# Altium schematic sheet RF_antenna.SchDoc
size A3; SheetNumber: 4; SheetTotal: 4
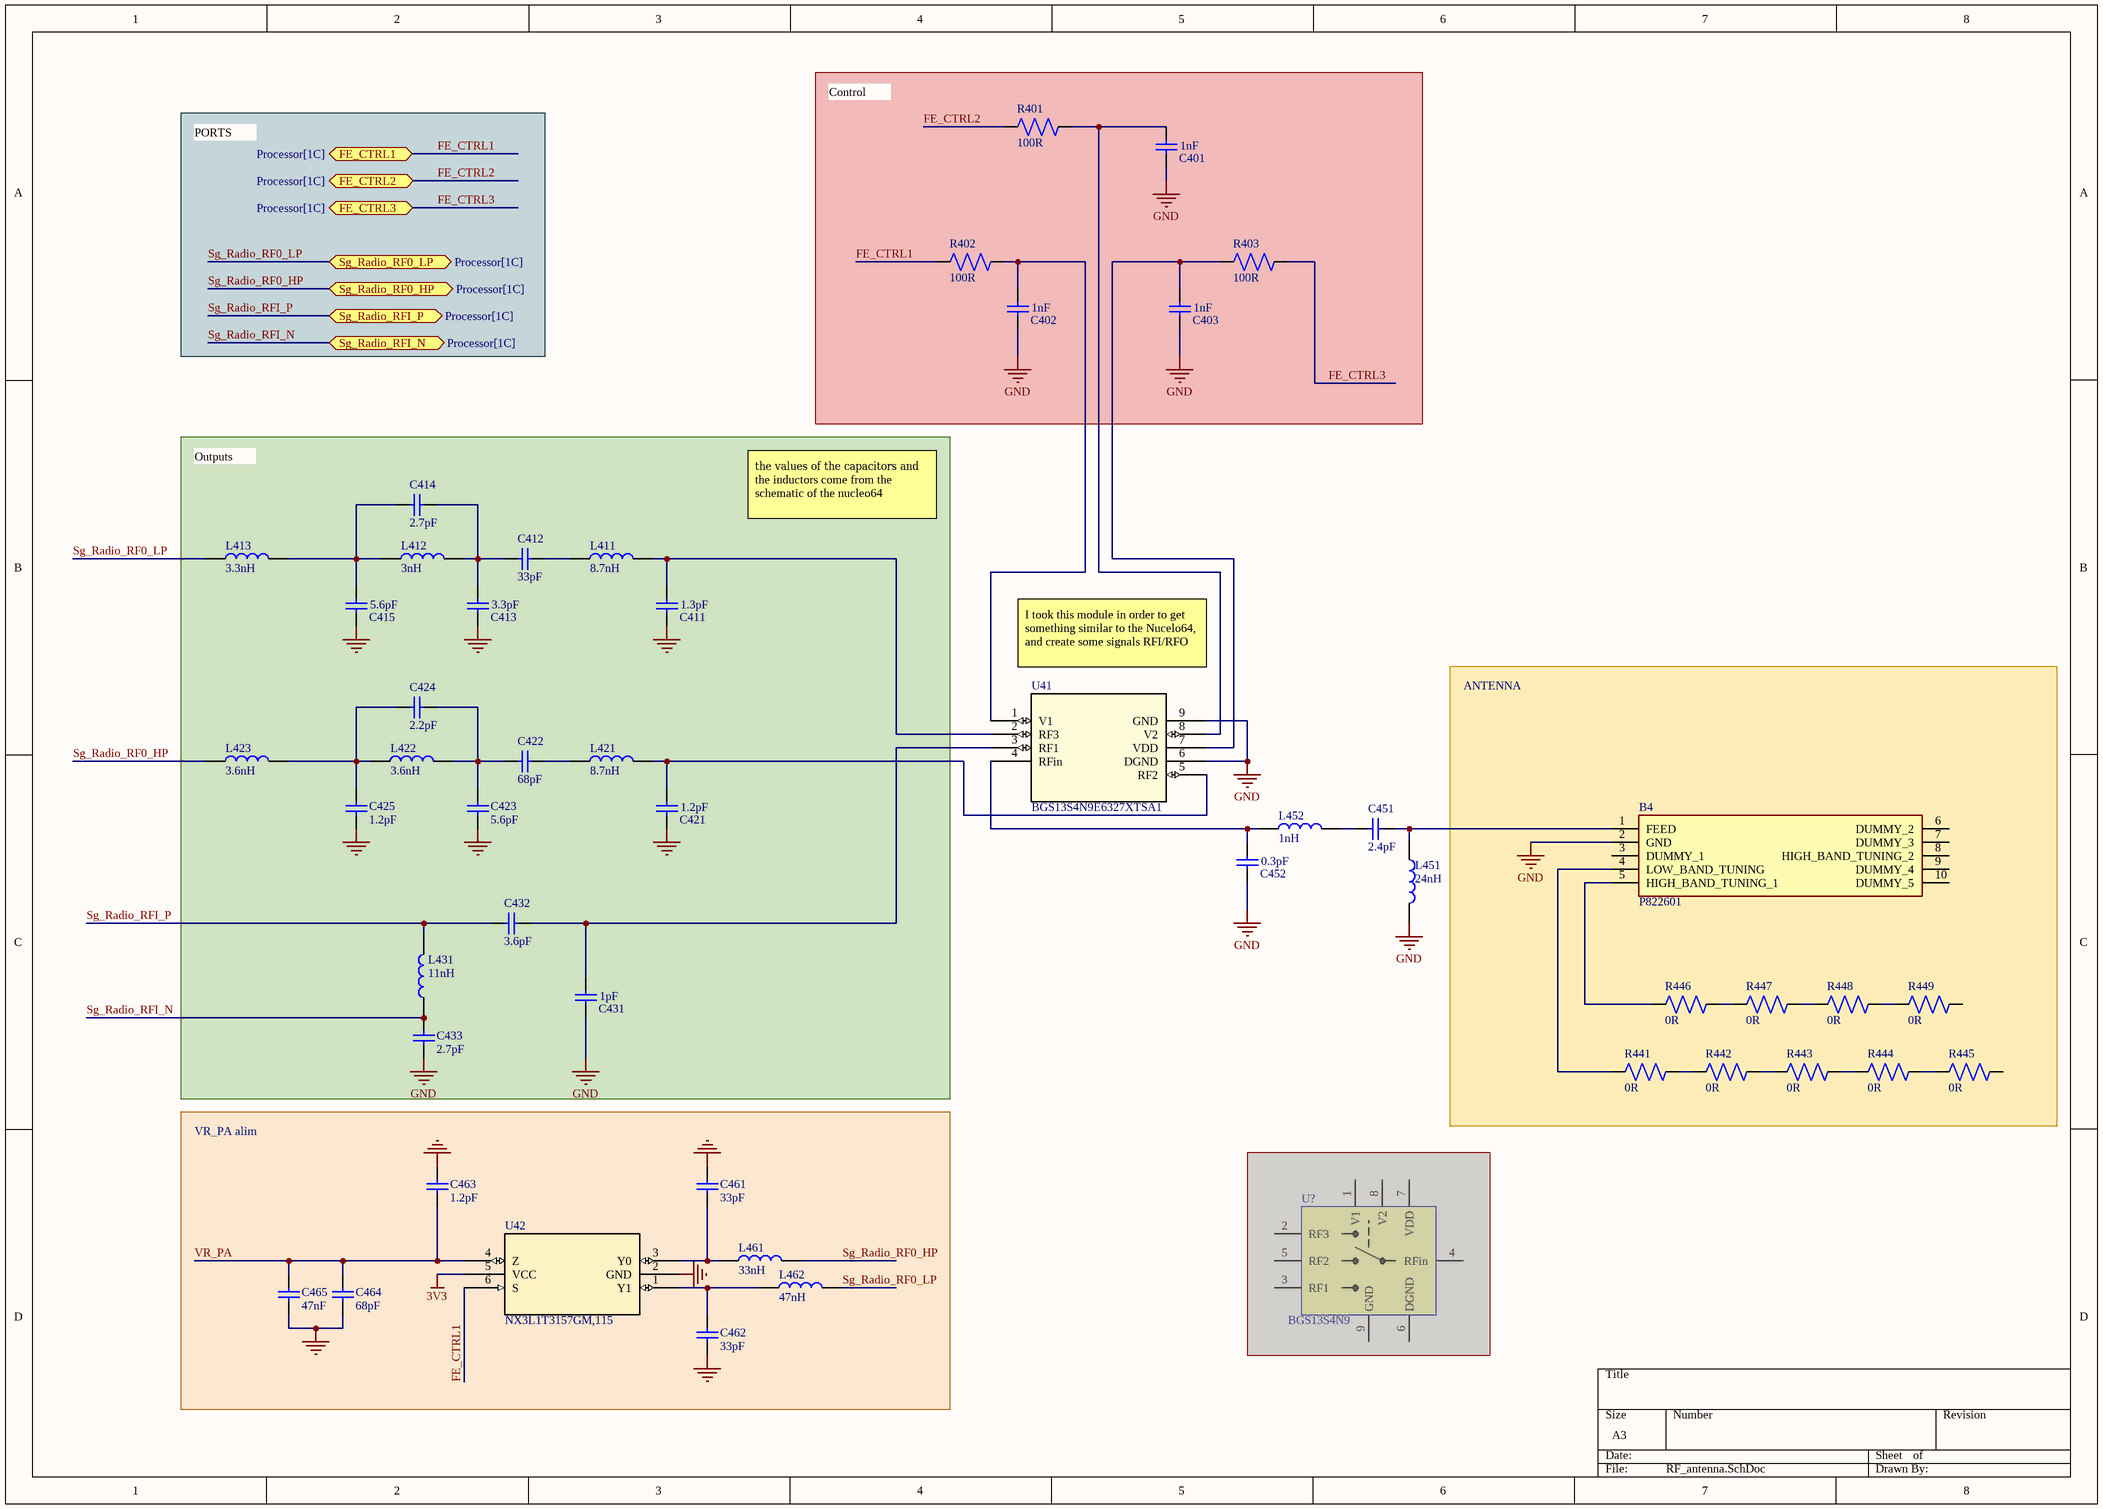
[diagram p0: RF_antenna.SchDoc]

## Parts
B4  P822601  [P822601]
C401  1nF  [CAPC1608X06L]
C402  1nF  [CAPC1608X06L]
C403  1nF  [CAPC1608X06L]
C411  1.3pF  [CAPC1608X06L]
C412  33pF  [CAPC1608X06L]
C413  3.3pF  [CAPC1608X06L]
C414  2.7pF  [CAPC1608X06L]
C415  5.6pF  [CAPC1608X06L]
C421  1.2pF  [CAPC1608X06L]
C422  68pF  [CAPC1608X06L]
C423  5.6pF  [CAPC1608X06L]
C424  2.2pF  [CAPC1608X06L]
C425  1.2pF  [CAPC1608X06L]
C431  1pF  [CAPC1608X06L]
C432  3.6pF  [CAPC1608X06L]
C433  2.7pF  [CAPC1608X06L]
C451  2.4pF  [CAPC1608X06L]
C452  0.3pF  [CAPC1608X06L]
C461  33pF  [CAPC1608X06L]
C462  33pF  [CAPC1608X06L]
C463  1.2pF  [CAPC1608X06L]
C464  68pF  [CAPC1608X06L]
C465  47nF  [CAPC1608X06L]
L411  8.7nH  [INDC1608X06L_WW]
L412  3nH  [INDC1608X06L_WW]
L413  3.3nH  [INDC1608X06L_WW]
L421  8.7nH  [INDC1608X06L_WW]
L422  3.6nH  [INDC1608X06L_WW]
L423  3.6nH  [INDC1608X06L_WW]
L431  11nH  [INDC1608X06L_WW]
L451  24nH  [INDC1608X06L_WW]
L452  1nH  [INDC1608X06L_WW]
L461  33nH  [INDC1608X06L_WW]
L462  47nH  [INDC1608X06L_WW]
R401  100R  [RESC1608X04.5L]
R402  100R  [RESC1608X04.5L]
R403  100R  [RESC1608X04.5L]
R441  0R  [RESC1608X04.5L]
R442  0R  [RESC1608X04.5L]
R443  0R  [RESC1608X04.5L]
R444  0R  [RESC1608X04.5L]
R445  0R  [RESC1608X04.5L]
R446  0R  [RESC1608X04.5L]
R447  0R  [RESC1608X04.5L]
R448  0R  [RESC1608X04.5L]
R449  0R  [RESC1608X04.5L]
U41  BGS13S4N9E6327XTSA1  [TSNP-9-3_INF]
U42  NX3L1T3157GM,115  [XSON6_SOT886_NXP]
U?  value BGS13S4N9  [ICC_TSNP-9-3_1P1X1P1_P040]  (masked out: inside a compile mask, not in the netlist)

## Blocks framed on the sheet
ANTENNA: B4 R441-R449
VR_PA alim: C461-C465 L461 L462 U42

## Ports
FE_CTRL1 (bidir, see Processor[1C]), FE_CTRL2 (bidir, see Processor[1C]), FE_CTRL3 (bidir, see Processor[1C]), Sg_Radio_RF0_HP (bidir, see Processor[1C]), Sg_Radio_RF0_LP (bidir, see Processor[1C]), Sg_Radio_RFI_N (bidir, see Processor[1C]), Sg_Radio_RFI_P (bidir, see Processor[1C])

## Nets
3V3: U42.5(VCC)
GND: B4.2(GND) C401.1 C402.1 C403.1 C411.1 C413.1 C415.1 C421.1 C423.2 C425.2 C431.1 C433.2 C452.1 C461.1 C462.2 C463.2 C464.2 C465.2 L451.2 U41.6(DGND) U41.9(GND) U42.2(GND)
FE_CTRL1: R402.1 U42.6(S) ; port FE_CTRL1
FE_CTRL2: R401.1 ; port FE_CTRL2
FE_CTRL3: R403.2 ; port FE_CTRL3
Sg_Radio_RF0_HP: L423.1 L461.2 ; port Sg_Radio_RF0_HP
Sg_Radio_RF0_LP: L413.1 L462.2 ; port Sg_Radio_RF0_LP
Sg_Radio_RFI_N: C433.1 L431.1 ; port Sg_Radio_RFI_N
Sg_Radio_RFI_P: C432.2 L431.2 ; port Sg_Radio_RFI_P
VR_PA: C463.1 C464.1 C465.1 U42.4(Z)
NetB4_1: B4.1(FEED) C451.1 L451.1
NetB4_4: B4.4(LOW_BAND_TUNING) R441.1
NetB4_5: B4.5(HIGH_BAND_TUNING_1) R446.1
NetC401_2: C401.2 R401.2 U41.8(V2)
NetC402_2: C402.2 R402.2 U41.1(V1)
NetC403_2: C403.2 R403.1 U41.7(VDD)
NetC411_2: C411.2 L411.2 U41.2(RF3)
NetC412_1: C412.1 L411.1
NetC412_2: C412.2 C413.2 C414.1 L412.2
NetC414_2: C414.2 C415.2 L412.1 L413.2
NetC421_2: C421.2 L421.2 U41.5(RF2)
NetC422_1: C422.1 L421.1
NetC422_2: C422.2 C423.1 C424.1 L422.2
NetC424_2: C424.2 C425.1 L422.1 L423.2
NetC431_2: C431.2 C432.1 U41.3(RF1)
NetC451_2: C451.2 L452.2
NetC452_2: C452.2 L452.1 U41.4(RFin)
NetC461_2: C461.2 L461.1 U42.3(Y0)
NetC462_1: C462.1 L462.1 U42.1(Y1)
NetR441_2: R441.2 R442.1
NetR442_2: R442.2 R443.1
NetR443_2: R443.2 R444.1
NetR444_2: R444.2 R445.1
NetR446_2: R446.2 R447.1
NetR447_2: R447.2 R448.1
NetR448_2: R448.2 R449.1

Not connected (* = marked no-connect by the designer): B4 3(DUMMY_1) 6(DUMMY_2) 7(DUMMY_3) 8(HIGH_BAND_TUNING_2) 9(DUMMY_4) 10(DUMMY_5); R445 2; R449 2

## Notes on the sheet
- Control
- PORTS
- Outputs
- the values ​​of the capacitors and the inductors come from the schematic of the nucleo64
- I took this module in order to get something similar to the Nucelo64, and create some signals RFI/RFO

## Library data of the parts
B4 = P822601: AVX - P822601 - EMBEDDED ANTENNA, 1.7-2.7GHZ, 3.4DBI; Geometry.Height: 3.5mm; Mouser Part Number: 581-P822601; Mouser Price/Stock: https://www.mouser.co.uk/ProductDetail/AVX/P822601?qs=vdi0iO8H4N0igrTLYxGIXg%3D%3D; Manufacturer_Name: AVX; Manufacturer_Part_Number: P822601; Datasheet Link: http://datasheets.avx.com/ethertronics/AVX-E_P822601-P822602.pdf
C401-C403 C411-C415 C421-C425 C431-C433 C451 C452 C461 C463-C465 = C0603-4µ7: Capacitor, X5R, ±10%
  C401-C403: Value: 1nF
  C411: Value: 1.3pF
  C412 C461: Value: 33pF
  C413: Value: 3.3pF
  C414 C433: Value: 2.7pF
  C415 C423: Value: 5.6pF
  C421 C425 C463: Value: 1.2pF
  C422 C464: Value: 68pF
  C424: Value: 2.2pF
  C431: Value: 1pF
  C432: Value: 3.6pF
  C451: Value: 2.4pF
  C452: Value: 0.3pF
  C465: Value: 47nF
C462 = C0603-4µ7: Capacitor, X5R, ±10%; Value: 2.4pF
L411 L412 L421-L423 L431 L451 L452 L461 L462 = L0603-33n-Wirewound-Murata: Inductor, 420mA, ±5%, 230mΩ, Q=40
  L411 L421: Value: 8.7nH
  L412: Value: 3nH
  L422 L423: Value: 3.6nH
  L431: Value: 11nH
  L451: Value: 24nH
  L452: Value: 1nH
  L461: Value: 33nH
  L462: Value: 47nH
L413 = L0603-33n-Wirewound-Murata: Inductor, 420mA, ±5%, 230mΩ, Q=40; Value: 3nH
R401-R403 = R0603: Resistor, ±1%, 0.063W; Value: 100
R441-R449 = R0603: Resistor, ±1%, 0.063W; Value: 0
U41 = BGS13S4N9E6327XTSA1: No Description Available; Mfr_Name: Infineon; RefDes: RefDes; Type: Type
U42 = NX3L1T3157GM,115: No Description Available; Mfr_Name: NXP; RefDes: RefDes; Type: Type
U? = MCD-02018: Wideband RF SP3T Switch; Part_Type: IC; Manufacturer: INFINEON; ECCN_US: EAR99; ECCN_EU: tbd; Provided_By: SUBCO; Internal_Part_Number: MCD-02018; Status: Checked; Manufacturer_Part_Number: BGS13S4N9; Package: TSNP-9-3; ComponentLink1Description: Datasheet; ComponentLink1URL: http://tunmcdsvn.tun.st.com/Component_Datasheet_Library/Trunk/IC/Infineon_SP3T_BGS13S4N9/Infineon-BGS13S4N9-DS-v01_00-EN.pdf